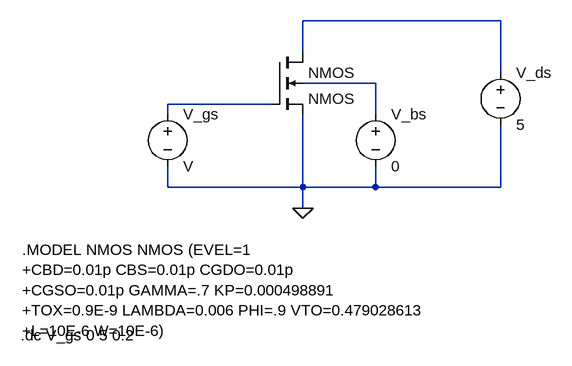
[diagram p0: schematic Experiment_1.asc]
Experiment_1.asc, the LTspice schematic file:
Version 4
SHEET 1 880 680
WIRE 496 32 192 32
WIRE 192 80 192 32
WIRE 496 112 496 32
WIRE 304 128 192 128
WIRE 144 160 -16 160
WIRE -16 176 -16 160
WIRE 304 176 304 128
WIRE -16 288 -16 256
WIRE 192 288 192 176
WIRE 192 288 -16 288
WIRE 304 288 304 256
WIRE 304 288 192 288
WIRE 496 288 496 192
WIRE 496 288 304 288
WIRE 192 320 192 288
FLAG 192 320 0
SYMBOL nmos4 144 80 R0
SYMATTR InstName NMOS
SYMBOL voltage -16 160 R0
SYMATTR InstName V_gs
SYMBOL voltage 304 160 R0
WINDOW 123 0 0 Left 0
WINDOW 39 0 0 Left 0
SYMATTR InstName V_bs
SYMATTR Value 0
SYMBOL voltage 496 96 R0
WINDOW 123 0 0 Left 0
WINDOW 39 0 0 Left 0
SYMATTR InstName V_ds
SYMATTR Value 5
TEXT -240 384 Left 2 !.MODEL NMOS NMOS (EVEL=1 \n+CBD=0.01p CBS=0.01p CGDO=0.01p \n+CGSO=0.01p GAMMA=.7 KP=0.000498891\n+TOX=0.9E-9 LAMBDA=0.006 PHI=.9 VTO=0.479028613\n+L=10E-6 W=10E-6)
TEXT -242 516 Left 2 !.dc V_gs 0 5 0.2

The netlist it stands for:
* Experiment_1.asc
M§NMOS N001 N003 0 N002 NMOS
V_gs N003 0 V
V_bs N002 0 0
V_ds N001 0 5
.model NMOS NMOS
.model PMOS PMOS
.lib standard.mos
.MODEL NMOS NMOS (EVEL=1
+CBD=0.01p CBS=0.01p CGDO=0.01p
+CGSO=0.01p GAMMA=.7 KP=0.000498891
+TOX=0.9E-9 LAMBDA=0.006 PHI=.9 VTO=0.479028613
+L=10E-6 W=10E-6)
.dc V_gs 0 5 0.2
.backanno
.end